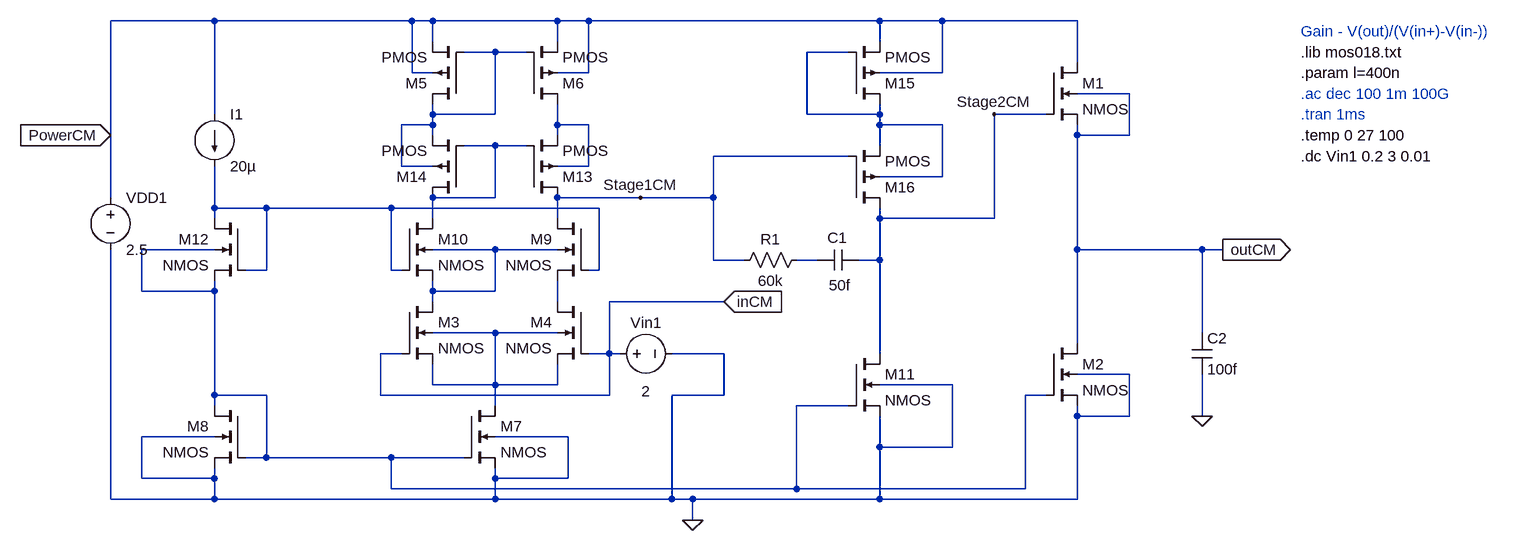
[diagram p0: schematic OCMR.asc]
OCMR.asc, the LTspice schematic file:
Version 4
SHEET 1 1316 680
WIRE -656 -192 -816 -192
WIRE -352 -192 -656 -192
WIRE -320 -192 -352 -192
WIRE -128 -192 -320 -192
WIRE -80 -192 -128 -192
WIRE 368 -192 -80 -192
WIRE 464 -192 368 -192
WIRE 672 -192 464 -192
WIRE -320 -160 -320 -192
WIRE -128 -160 -128 -192
WIRE 368 -160 368 -192
WIRE -224 -144 -272 -144
WIRE -176 -144 -224 -144
WIRE 320 -144 256 -144
WIRE 672 -128 672 -192
WIRE -352 -112 -352 -192
WIRE -320 -112 -352 -112
WIRE -80 -112 -80 -192
WIRE -80 -112 -128 -112
WIRE 464 -112 464 -192
WIRE 464 -112 368 -112
WIRE 752 -80 672 -80
WIRE -656 -48 -656 -192
WIRE -320 -48 -320 -64
WIRE -224 -48 -224 -144
WIRE -224 -48 -320 -48
WIRE 256 -48 256 -144
WIRE 368 -48 368 -64
WIRE 368 -48 256 -48
WIRE 624 -48 544 -48
WIRE -320 -32 -320 -48
WIRE -320 -32 -368 -32
WIRE -128 -32 -128 -64
WIRE -80 -32 -128 -32
WIRE 368 -32 368 -48
WIRE 464 -32 368 -32
WIRE -816 -16 -816 -192
WIRE -320 -16 -320 -32
WIRE -128 -16 -128 -32
WIRE 672 -16 672 -32
WIRE 752 -16 752 -80
WIRE 752 -16 672 -16
WIRE -224 0 -272 0
WIRE -176 0 -224 0
WIRE 368 0 368 -32
WIRE 320 16 112 16
WIRE -368 32 -368 -32
WIRE -320 32 -368 32
WIRE -80 32 -80 -32
WIRE -80 32 -128 32
WIRE 464 48 464 -32
WIRE 464 48 368 48
WIRE -816 80 -816 -16
WIRE -224 80 -224 0
WIRE -224 80 -320 80
WIRE 0 80 -128 80
WIRE 112 80 112 16
WIRE 112 80 0 80
WIRE -656 96 -656 32
WIRE -576 96 -656 96
WIRE -384 96 -576 96
WIRE -64 96 -384 96
WIRE -656 112 -656 96
WIRE -320 112 -320 80
WIRE -128 112 -128 80
WIRE 368 112 368 96
WIRE 544 112 544 -48
WIRE 544 112 368 112
WIRE -656 160 -768 160
WIRE -224 160 -320 160
WIRE -128 160 -224 160
WIRE 672 160 672 -16
WIRE 864 160 672 160
WIRE 896 160 864 160
WIRE 112 176 112 80
WIRE 160 176 112 176
WIRE 272 176 240 176
WIRE 368 176 368 112
WIRE 368 176 336 176
WIRE -576 192 -576 96
WIRE -576 192 -608 192
WIRE -384 192 -384 96
WIRE -368 192 -384 192
WIRE -64 192 -64 96
WIRE -64 192 -80 192
WIRE -768 224 -768 160
WIRE -656 224 -656 208
WIRE -656 224 -768 224
WIRE -320 224 -320 208
WIRE -224 224 -224 160
WIRE -224 224 -320 224
WIRE -320 240 -320 224
WIRE -128 240 -128 208
WIRE 128 240 -48 240
WIRE -224 288 -320 288
WIRE -128 288 -224 288
WIRE 864 288 864 160
WIRE 672 304 672 160
WIRE -368 320 -400 320
WIRE -48 320 -48 240
WIRE -48 320 -80 320
WIRE -32 320 -48 320
WIRE 128 320 48 320
WIRE 368 320 368 176
WIRE 752 352 672 352
WIRE -320 368 -320 336
WIRE -224 368 -224 288
WIRE -224 368 -320 368
WIRE -128 368 -128 336
WIRE -128 368 -224 368
WIRE 480 368 368 368
WIRE -656 384 -656 224
WIRE -576 384 -656 384
WIRE -400 384 -400 320
WIRE -48 384 -48 320
WIRE -48 384 -400 384
WIRE 128 384 128 320
WIRE 128 384 48 384
WIRE 624 384 592 384
WIRE -656 400 -656 384
WIRE -224 400 -224 368
WIRE 320 400 240 400
WIRE 672 416 672 400
WIRE 752 416 752 352
WIRE 752 416 672 416
WIRE 864 416 864 352
WIRE -656 448 -768 448
WIRE -112 448 -224 448
WIRE 368 464 368 416
WIRE 480 464 480 368
WIRE 480 464 368 464
WIRE -576 480 -576 384
WIRE -576 480 -608 480
WIRE -384 480 -576 480
WIRE -272 480 -384 480
WIRE -768 512 -768 448
WIRE -656 512 -656 496
WIRE -656 512 -768 512
WIRE -224 512 -224 496
WIRE -112 512 -112 448
WIRE -112 512 -224 512
WIRE -384 528 -384 480
WIRE 240 528 240 400
WIRE 240 528 -384 528
WIRE 592 528 592 384
WIRE 592 528 240 528
WIRE -816 544 -816 160
WIRE -656 544 -656 512
WIRE -656 544 -816 544
WIRE -224 544 -224 512
WIRE -224 544 -656 544
WIRE 48 544 48 384
WIRE 48 544 -224 544
WIRE 80 544 48 544
WIRE 368 544 368 464
WIRE 368 544 80 544
WIRE 672 544 672 416
WIRE 672 544 368 544
WIRE 80 576 80 544
FLAG 896 160 outCM
IOPIN 896 160 Out
FLAG 80 576 0
FLAG 128 240 inCM
IOPIN 128 240 In
FLAG 0 80 Stage1CM
FLAG 544 -48 Stage2CM
FLAG -816 -16 PowerCM
IOPIN -816 -16 In
FLAG 864 416 0
SYMBOL nmos4 624 -128 R0
SYMATTR InstName M1
SYMATTR Value2 l={l} w=0.5u m=20
SYMBOL nmos4 624 304 R0
SYMATTR InstName M2
SYMATTR Value2 l={l} w=10u m=3
SYMBOL nmos4 -368 240 R0
SYMATTR InstName M3
SYMATTR Value2 l={l} w=0.5u m=1
SYMBOL nmos4 -80 240 M0
SYMATTR InstName M4
SYMATTR Value2 l={l} w=0.5u m=1
SYMBOL pmos4 -272 -64 R180
SYMATTR InstName M5
SYMATTR Value2 l={l} w=1u m=2
SYMBOL pmos4 -176 -64 M180
SYMATTR InstName M6
SYMATTR Value2 l={l} w=1u m=2
SYMBOL nmos4 -272 400 R0
SYMATTR InstName M7
SYMATTR Value2 l={l} w=2u
SYMBOL current -656 -48 R0
WINDOW 123 0 0 Left 0
WINDOW 39 0 0 Left 0
SYMATTR InstName I1
SYMATTR Value 20µ
SYMBOL nmos4 -608 400 M0
SYMATTR InstName M8
SYMATTR Value2 l={l} w=10u
SYMBOL voltage -816 64 R0
WINDOW 123 0 0 Left 0
WINDOW 39 0 0 Left 0
SYMATTR InstName VDD1
SYMATTR Value 2.5
SYMBOL voltage -48 320 R270
WINDOW 0 32 56 VTop 2
WINDOW 3 -42 56 VBottom 2
WINDOW 123 -2 206 VBottom 2
WINDOW 39 -1 235 VBottom 2
SYMATTR InstName Vin1
SYMATTR Value 2
SYMBOL nmos4 -80 112 M0
SYMATTR InstName M9
SYMATTR Value2 l={l} w=0.5u m=1
SYMBOL nmos4 -368 112 R0
SYMATTR InstName M10
SYMATTR Value2 l={l} w=0.5u m=1
SYMBOL nmos4 320 320 R0
SYMATTR InstName M11
SYMATTR Value2 l={l} w=1u m=5
SYMBOL cap 336 160 R90
WINDOW 0 -3 33 VBottom 2
WINDOW 3 39 29 VTop 2
SYMATTR InstName C1
SYMATTR Value 50f
SYMBOL nmos4 -608 112 M0
SYMATTR InstName M12
SYMATTR Value2 l={l} w=1u
SYMBOL pmos4 -176 80 M180
SYMATTR InstName M13
SYMATTR Value2 l={l} w=1u m=1
SYMBOL pmos4 -272 80 R180
SYMATTR InstName M14
SYMATTR Value2 l={l} w=1u m=1
SYMBOL pmos4 320 -64 M180
SYMATTR InstName M15
SYMATTR Value2 l={l} w=0.5u m=25
SYMBOL pmos4 320 96 M180
SYMATTR InstName M16
SYMATTR Value2 l={l} w=0.5u m=10
SYMBOL res 256 160 R90
WINDOW 0 0 56 VBottom 2
WINDOW 3 32 56 VTop 2
SYMATTR InstName R1
SYMATTR Value 60k
SYMBOL cap 848 288 R0
SYMATTR InstName C2
SYMATTR Value 100f
TEXT 1016 -48 Left 2 ;.tran 1ms
TEXT 1016 -16 Left 2 !.temp 0 27 100
TEXT 1016 -80 Left 2 ;.ac dec 100 1m 100G
TEXT 1016 -112 Left 2 !.param l=400n
TEXT 1016 -144 Left 2 !.lib mos018.txt
TEXT 1016 -176 Left 2 ;Gain - V(out)/(V(in+)-V(in-))
TEXT 1016 16 Left 2 !.dc Vin1 0.2 3 0.01

The netlist it stands for:
* OCMR.asc
M1 PowerCM Stage2CM outCM outCM NMOS l={l} w=0.5u m=20
M2 outCM N006 0 0 NMOS l={l} w=10u m=3
M3 N007 inCM N010 N010 NMOS l={l} w=0.5u m=1
M4 N009 inCM N010 N010 NMOS l={l} w=0.5u m=1
M5 N001 N001 PowerCM PowerCM PMOS l={l} w=1u m=2
M6 N003 N001 PowerCM PowerCM PMOS l={l} w=1u m=2
M7 N010 N006 0 0 NMOS l={l} w=2u
I1 PowerCM N005 20µ
M8 N006 N006 0 0 NMOS l={l} w=10u
VDD1 PowerCM 0 2.5
Vin1 inCM 0 2
M9 Stage1CM N005 N009 N007 NMOS l={l} w=0.5u m=1
M10 N004 N005 N007 N007 NMOS l={l} w=0.5u m=1
M11 Stage2CM N006 0 0 NMOS l={l} w=1u m=5
C1 Stage2CM N008 50f
M12 N005 N005 N006 N006 NMOS l={l} w=1u
M13 Stage1CM N004 N003 N003 PMOS l={l} w=1u m=1
M14 N004 N004 N001 N001 PMOS l={l} w=1u m=1
M15 N002 N002 PowerCM PowerCM PMOS l={l} w=0.5u m=25
M16 Stage2CM Stage1CM N002 N002 PMOS l={l} w=0.5u m=10
R1 N008 Stage1CM 60k
C2 outCM 0 100f
.model NMOS NMOS
.model PMOS PMOS
.lib standard.mos
* .tran 1ms
.temp 0 27 100
* .ac dec 100 1m 100G
.param l=400n
.lib mos018.txt
* Gain - V(out)/(V(in+)-V(in-))
.dc Vin1 0.2 3 0.01
.backanno
.end